# EAGLE design arduino_uno_shield (EAGLE 7.1.0)
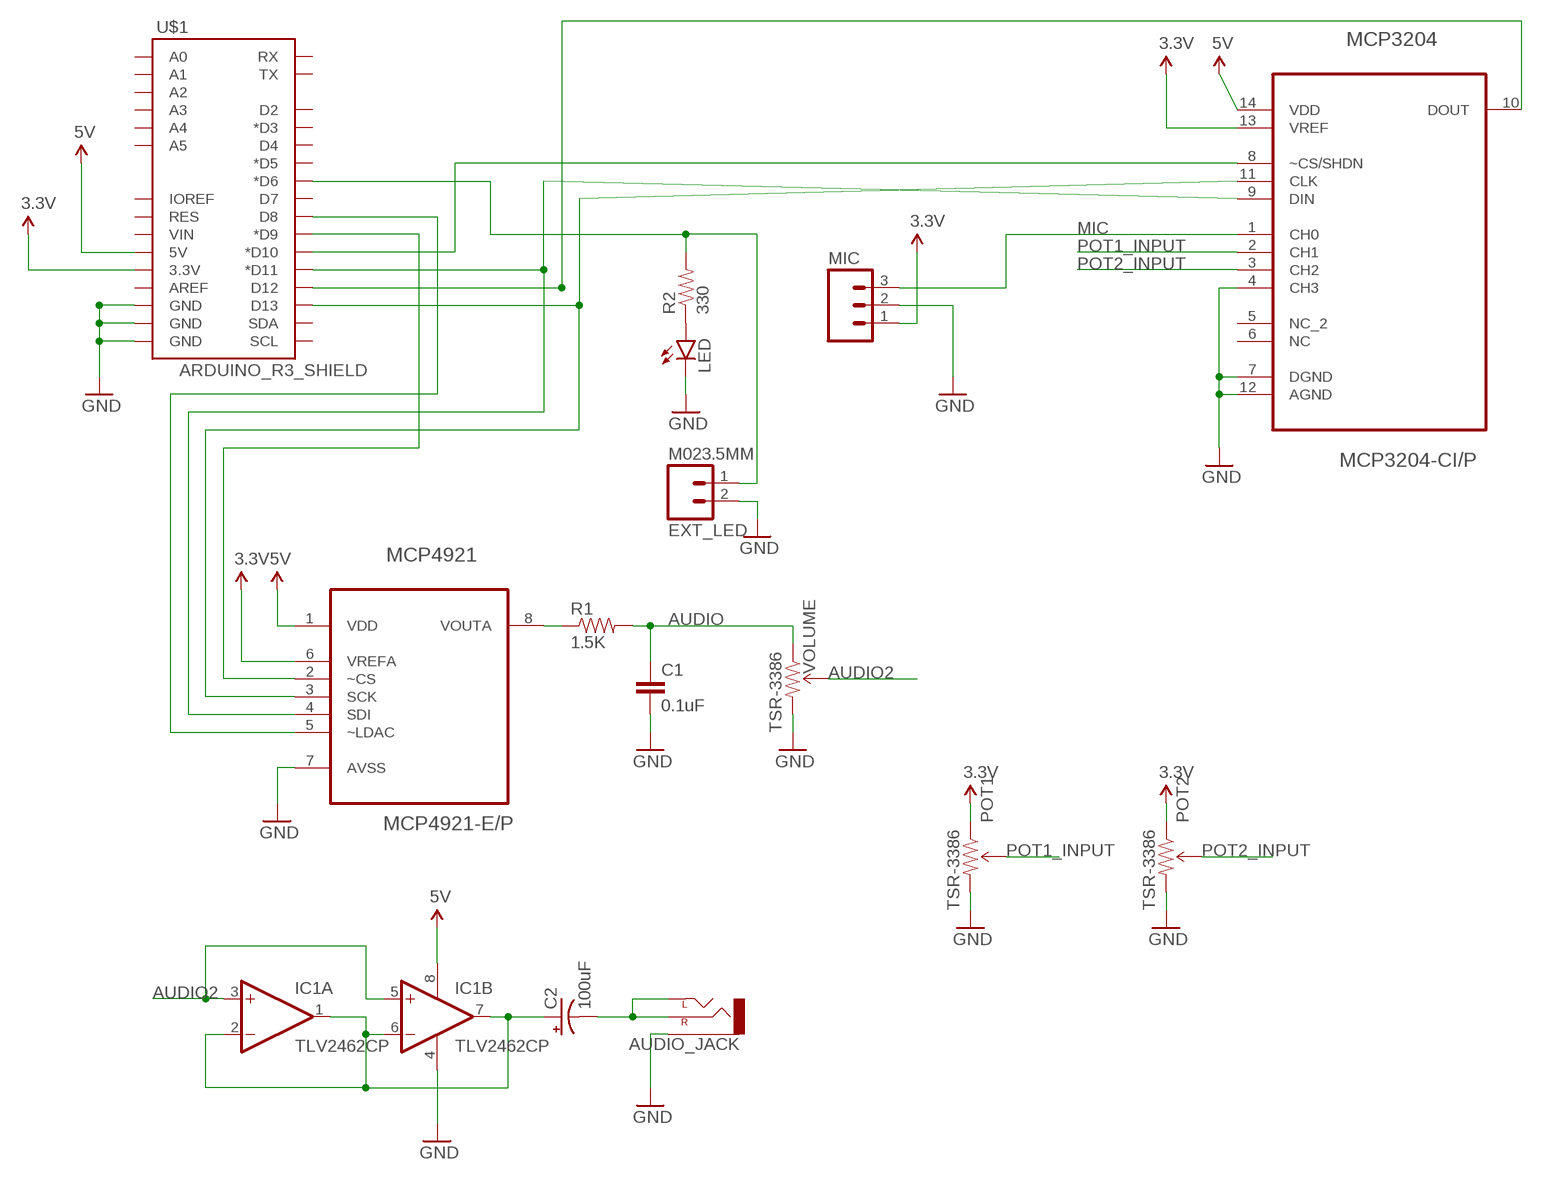
[diagram p0: schematic, sheet 1]

## Parts
AUDIO_JACK  AUDIO-JACKPTH  [AUDIO-JACK]
C1  0.1uF  CAPPTH  [CAP-PTH-SMALL]
C2  100uF  CAP_POLPTH1  [CPOL-RADIAL-100UF-25V]
EXT_LED  M023.5MM  [SCREWTERMINAL-3.5MM-2]
IC1  TLV2462CP  TL072P  [DIL08]
LED  LED5MM  [LED5MM]
MCP3204  MCP3204-CI/P  [DIP254P762X432-14]
MCP4921  MCP4921-E/P  [DIP254P762X432-8]
MIC  M03PTH  [1X03]
POT1  TSR-3386  TRIMPOT-PTH-KNOB  [3386U]
POT2  TSR-3386  TRIMPOT-PTH-KNOB  [3386U]
R1  1.5K  RESISTORPTH-1/4W  [AXIAL-0.4]
R2  330  RESISTORPTH-1/4W  [AXIAL-0.4]
U$1  ARDUINO_R3_SHIELD  [UNO_R3_SHIELD]
VOLUME  TSR-3386  TRIMPOT-PTH-KNOB  [3386U]

## Nets
3.3V: MCP3204.13(VREF) MCP4921.6(VREFA) MIC.1 POT1.1(CCW) POT2.1(CCW) U$1.3.3V
5V: IC1.8(P:V+) MCP3204.14(VDD) MCP4921.1(VDD) U$1.5V
AUDIO: C1.1 R1.P$2 VOLUME.1(CCW)
AUDIO2: IC1.3(A:+IN) IC1.5(B:+IN) VOLUME.2(WIPER)
CS_ADC: MCP3204.8(~CS/SHDN) U$1.D10(*D10)
CS_DAC: MCP4921.2(~CS) U$1.D9(*D9)
GND: AUDIO_JACK.SLEEVE C1.2 EXT_LED.2 IC1.4(P:V-) LED.K(C) MCP3204.4(CH3) MCP3204.7(DGND) MCP3204.12(AGND) MCP4921.7(AVSS) MIC.2 POT1.3(CW) POT2.3(CW) U$1.GND@0(GND) U$1.GND@1(GND) U$1.GND@2(GND) VOLUME.3(CW)
MIC: MCP3204.1(CH0) MIC.3
N$3: MCP4921.8(VOUTA) R1.P$1
N$4: C2.1(+) IC1.1(A:OUT) IC1.2(A:-IN) IC1.6(B:-IN) IC1.7(B:OUT)
N$5: AUDIO_JACK.RING(RIGHT) AUDIO_JACK.TIP(LEFT) C2.2(-)
N$10: LED.A R2.P$1
N$11: MCP4921.5(~LDAC) U$1.D8
N$12: EXT_LED.1 R2.P$2 U$1.D6(*D6)
POT1_INPUT: MCP3204.2(CH1) POT1.2(WIPER)
POT2_INPUT: MCP3204.3(CH2) POT2.2(WIPER)
SPI_CLK: MCP3204.11(CLK) MCP4921.3(SCK) U$1.D13
SPI_MISO: MCP3204.10(DOUT) U$1.D12
SPI_MOSI: MCP3204.9(DIN) MCP4921.4(SDI) U$1.D11(*D11)
Unconnected: MCP3204.5(NC_2) MCP3204.6(NC) U$1.A0 U$1.A1 U$1.A2 U$1.A3 U$1.A4 U$1.A5 U$1.AREF U$1.D2 U$1.D3(*D3) U$1.D4 U$1.D5(*D5) U$1.D7 U$1.IOREF U$1.RES U$1.RX U$1.SCL U$1.SDA U$1.TX U$1.VIN

## Library data of the parts
AUDIO_JACK = SparkFun-Connectors:AUDIO-JACK: 3.5mm Audio Jack Simple 3.5mm common PCB mount audio jack. SKU: PRT-08032
C1 = SparkFun-Passives:CAP: Capacitor Standard 0603 ceramic capacitor, and 0.1" leaded capacitor.
C2 = SparkFun-Capacitors:CAP_POL: Capacitor Polarized These are standard SMD and PTH capacitors. Normally 10uF, 47uF, and 100uF in electrolytic and tantalum varieties. Always verify the external diameter of the through hole cap, it varies with capacity, voltage, and manufacturer. The EIA devices should be standard.
EXT_LED = SparkFun-Connectors:M02: Standard 2-pin 0.1" header. Use with - straight break away headers ( PRT-00116) - right angle break away headers (PRT-00553) - swiss pins (PRT-00743) - machine pins (PRT-00117) - female headers (PRT-00115) Molex polarized connector foot print use with: PRT-08233 with associated crimp pins and housings. 2.54_SCREWTERM for use with PRT-10571. 3.5mm Screw Terminal footprints for PRT-08084 5mm Screw Terminal footprints for use with PRT-08433
IC1 = linear:TL072: OP AMP
LED = SparkFun-LED:LED: LEDs Standard schematic elements and footprints for 5mm, 3mm, 1206, and 0603 sized LEDs. 5mm - Spark Fun Electronics SKU : COM-00529 (and others)
MCP3204 = Microchip_By_element14_Batch_1:MCP3204-CI/P: A/D Converters; MPN: MCP3204-CI/P; OC_FARNELL: 9758593; OC_NEWARK: 19C7209; PACKAGE: DIP-14; SUPPLIER: Microchip
MCP4921 = Microchip_By_element14_Batch_1:MCP4921-E/P: DAC; MPN: MCP4921-E/P; OC_FARNELL: 1332112; OC_NEWARK: 08J8743; PACKAGE: DIP-8; SUPPLIER: Microchip
MIC = SparkFun-Connectors:M03: Header 3 Standard 3-pin 0.1" header. Use with straight break away headers (SKU : PRT-00116), right angle break away headers (PRT-00553), swiss pins (PRT-00743), machine pins (PRT-00117), and female headers (PRT-00115). Molex polarized connector foot print use with SKU : PRT-08232 with associated crimp pins and housings.
POT1 POT2 VOLUME = SparkFun-Electromechanical:TRIMPOT: Various small potentiometers for "set-and-forget" applications; PROD_ID: RES-09730
R1 R2 = SparkFun-Passives:RESISTOR: Resistor Basic schematic elements and footprints for 0603, 1206, and PTH resistors.
U$1 = SparkFun-Boards:ARDUINO_R3_SHIELD: Shield form compatible with the Arduino Uno R3.

## Board
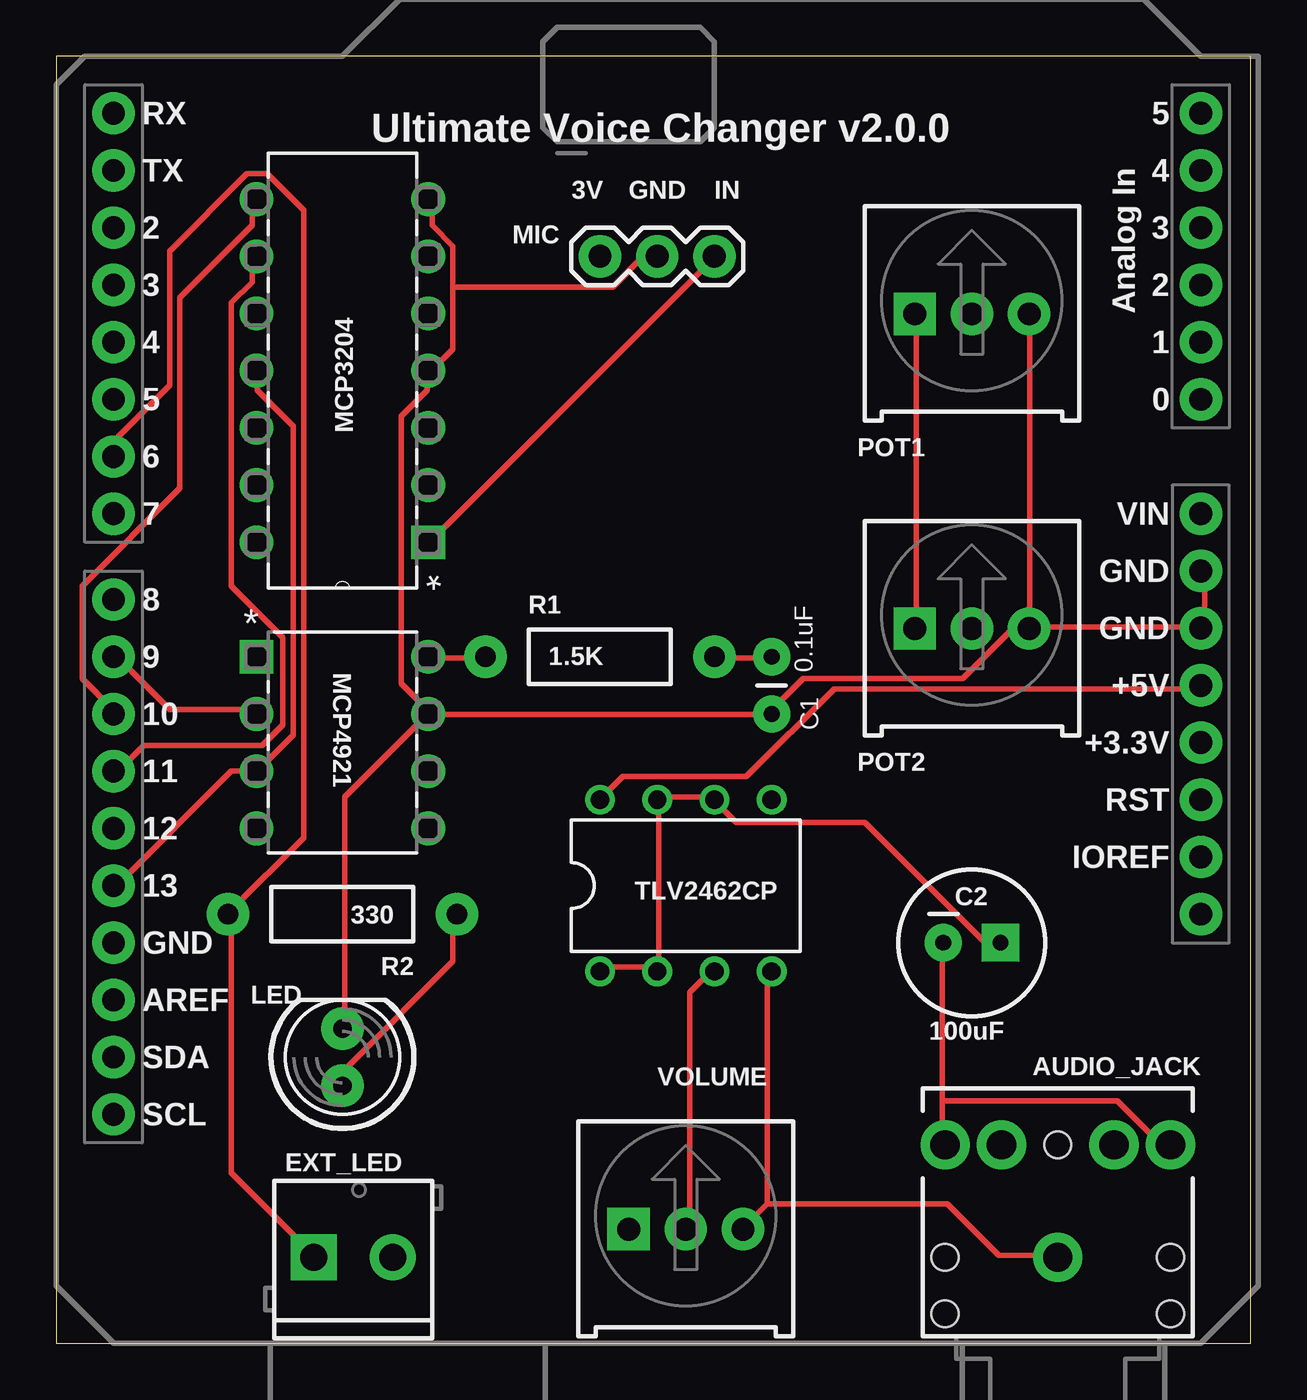
[diagram p1: board, top side]
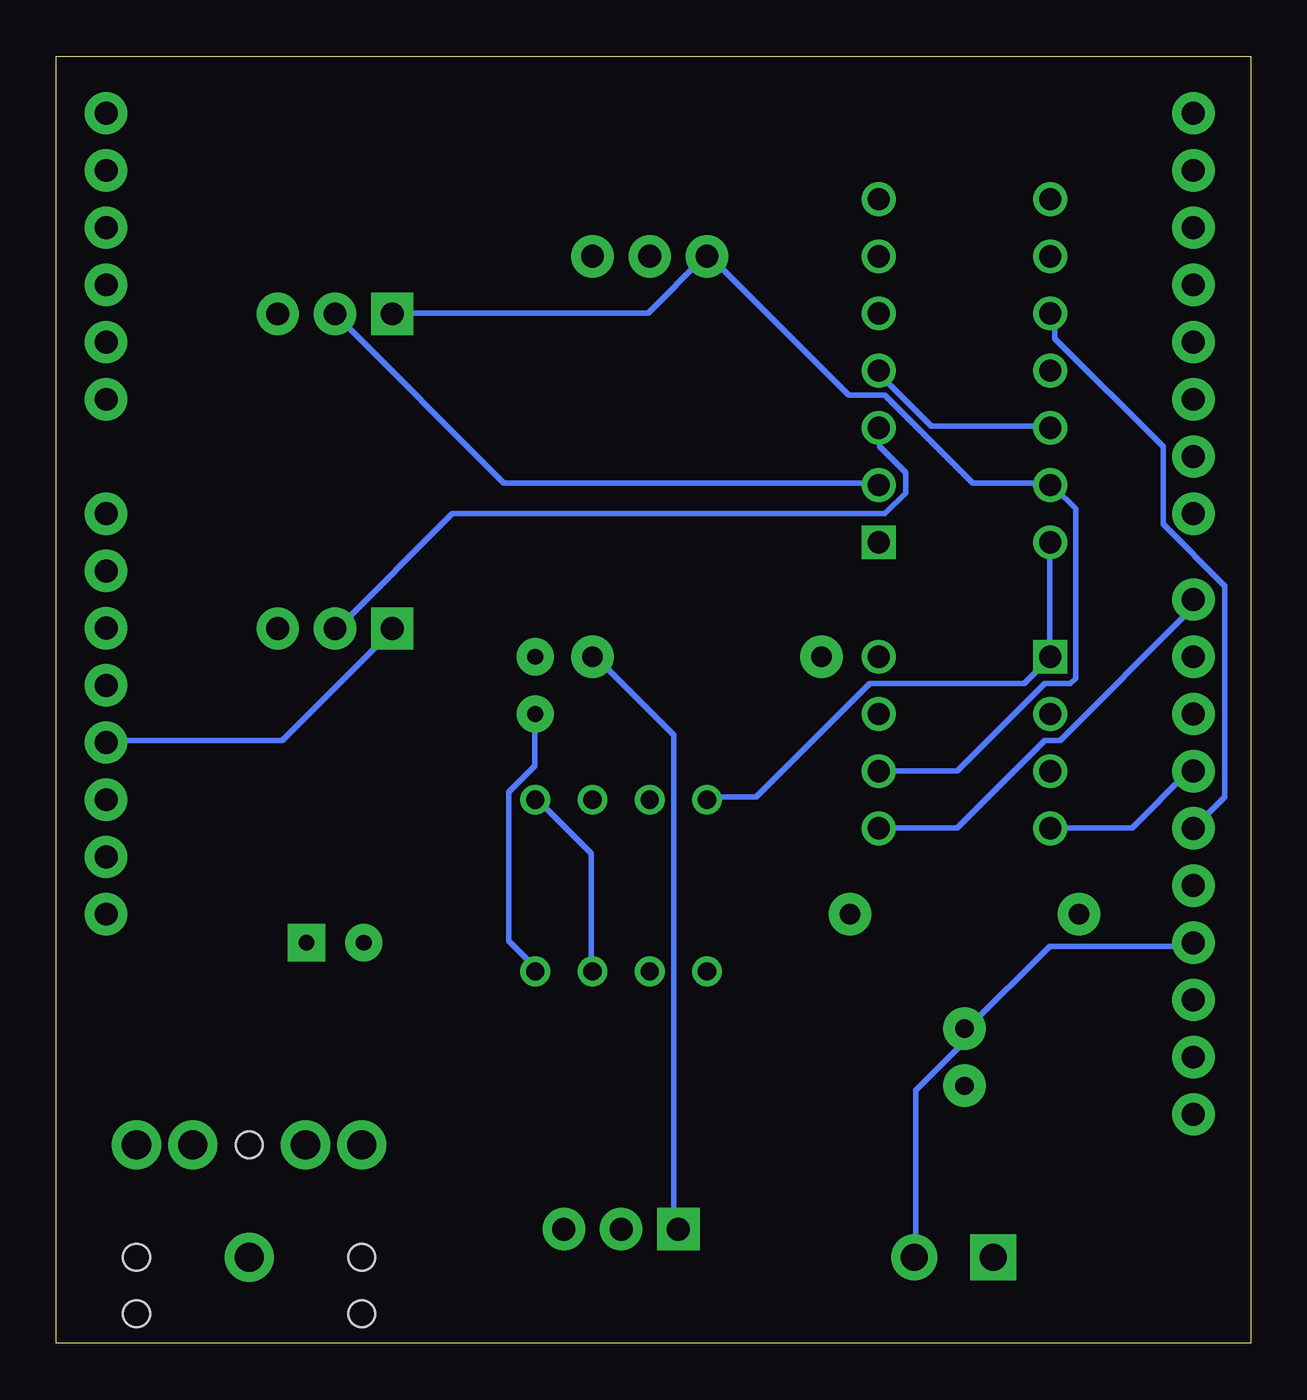
[diagram p2: board, bottom side, seen from below]

Size 53.01 x 57.14 mm. Coordinates in mm from the lower left corner, seen from the top.
Outline: 0,0 53.01,0 53.01,57.14 0,57.14 0,0
Copper layers (1*16): Top 0.035mm / dielectric 1.5mm / Bottom 0.035mm
Design rules "default": minimum track width 10mil, minimum drill 24mil, track to track 8mil, track to pad 8mil, pad to pad 8mil, via to via 8mil, smd to smd 8mil, copper to edge 40mil, drill to drill 8mil, minimum pad ring 10mil, minimum via ring 8mil, stop-mask expansion 4mil, vias tented up to drill 0mil, thermal gap 10mil

### Footprints (pad centres in the part's own frame; a part is rotated, then mirrored left to right if it is on the bottom)
AUDIO-JACK = drill 1.3 pad 2.184: RING 5,5; RSH 5,2.5; SLEEVE 0,0; TIP 5,-5; TSH 5,-2.5 | hole 1.2: 0,5; -2.5,5; -2.5,-5; 0,-5; 5,0
CAP-PTH-SMALL = drill 0.7 pad 1.651: 1 0,0; 2 2.54,0
CPOL-RADIAL-100UF-25V = drill 0.7 pad 1.651 square: 1 1.27,0 | drill 0.7 pad 1.651: 2 -1.27,0
SCREWTERMINAL-3.5MM-2 = drill 1.2 pad 2.032 square: 1 0,0 | drill 1.2 pad 2.032: 2 3.5,0
DIL08 = drill 0.813 pad 1.27: 1 -3.81,-3.81; 2 -1.27,-3.81; 3 1.27,-3.81; 4 3.81,-3.81; 5 3.81,3.81; 6 1.27,3.81; 7 -1.27,3.81; 8 -3.81,3.81
LED5MM = drill 0.813 pad 1.88: A -1.27,0; K 1.27,0
DIP254P762X432-14 = drill 0.991 square: 1 -7.62,15.24 | drill 0.991: 2 -7.62,12.7; 3 -7.62,10.16; 4 -7.62,7.62; 5 -7.62,5.08; 6 -7.62,2.54; 7 -7.62,0; 8 0,0; 9 0,2.54; 10 0,5.08; 11 0,7.62; 12 0,10.16; 13 0,12.7; 14 0,15.24
DIP254P762X432-8 = drill 0.991 square: 1 -7.62,7.62 | drill 0.991: 2 -7.62,5.08; 3 -7.62,2.54; 4 -7.62,0; 5 0,0; 6 0,2.54; 7 0,5.08; 8 0,7.62
1X03 = drill 1.016 pad 1.88: 1 0,0; 2 2.54,0; 3 5.08,0
3386U = drill 1.016 pad 1.88 square: 1 -2.54,-0.015 | drill 1.016 pad 1.88: 2 0,-0.015; 3 2.54,-0.015
AXIAL-0.4 = drill 0.9 pad 1.88: P$1 -5.08,0; P$2 5.08,0
UNO_R3_SHIELD = drill 1.016 pad 1.88: 3.3V 50.8,26.67; 5V 50.8,29.21; A0 50.8,41.91; A1 50.8,44.45; A2 50.8,46.99; A3 50.8,49.53; A4 50.8,52.07; A5 50.8,54.61; AREF 2.54,15.24; D2 2.54,49.53; D3 2.54,46.99; D4 2.54,44.45; D5 2.54,41.91; D6 2.54,39.37; D7 2.54,36.83; D8 2.54,33.02; D9 2.54,30.48; D10 2.54,27.94; D11 2.54,25.4; D12 2.54,22.86; D13 2.54,20.32; GND@0 50.8,31.75; GND@1 50.8,34.29; GND@2 2.54,17.78; IOREF 50.8,21.59; NC 50.8,19.05; RES 50.8,24.13; RX 2.54,54.61; SCL 2.54,10.16; SDA 2.54,12.7; TX 2.54,52.07; VIN 50.8,36.83

### Placement (x,y rotation side)
AUDIO_JACK  44.45,3.81 90 top
C1  31.75,30.48 270 top
C2  40.64,17.78 0 top
EXT_LED  11.43,3.81 0 top
IC1  27.94,20.32 0 top
LED  12.7,12.7 90 top
MCP3204  8.89,50.8 180 top
MCP4921  16.51,22.86 0 top
MIC  24.13,48.26 0 top
POT1  40.64,45.72 0 top
POT2  40.64,31.75 0 top
R1  24.13,30.48 0 top
R2  12.7,19.05 180 top
U$1  0,0 0 top
VOLUME  27.94,5.08 0 top

### Tracks (layer width: path | path; a pad name or v marks a point on that pad's centre or on a via)
3.3V
  Top 0.254: POT2.1 38.18,31.8 38.18,45.52 POT1.1
  Bottom 0.254: U$1.3.3V 50.75,26.77 42.98,26.77 38.18,31.57 POT2.1 | MCP4921.6 13.03,25.4 9.14,29.29 8,29.29 7.77,29.52 7.77,37.06 8.69,37.97 MCP3204.13 8.91,38.2 12.34,38.2 16.23,42.09 17.83,42.09 24,48.26 MIC.1 24.23,48.26 26.75,45.74 37.95,45.74 POT1.1
5V
  Top 0.254: U$1.5V 50.75,29.06 34.52,29.06 30.63,25.17 25.15,25.17 24.23,24.26 IC1.8
  Bottom 0.254: IC1.8 24,24.26 21.95,24.26 16.92,29.29 10.06,29.29 8.91,30.43 MCP4921.1 8.91,30.66 8.91,35.46 MCP3204.14
AUDIO
  Top 0.254: C1.1 31.55,30.43 29.26,30.43 R1.P$2
  Bottom 0.254: VOLUME.1 25.6,5.28 25.6,27 29.03,30.43 R1.P$2
AUDIO2
  Top 0.254: VOLUME.2 28.12,5.28 28.12,15.57 29.03,16.48 IC1.3
  Bottom 0.254: IC1.3 29.26,16.71 29.26,21.74 31.55,24.03 IC1.5
CS_ADC
  Top 0.254: MCP3204.8 8.69,50.77 8.69,49.63 5.49,46.43 5.49,37.97 1.14,33.63 1.14,29.52 2.52,28.14 U$1.D10
CS_DAC
  Top 0.254: MCP4921.2 8.69,28.14 5.03,28.14 2.74,30.43 U$1.D9
GND
  Top 0.254: 17.6,46.89 17.6,44.15 16.69,43.23 MCP3204.4 16.46,43 16.46,42.32 15.32,41.17 15.32,29.29 16.46,28.14 MCP4921.7 | 17.6,46.89 17.6,48.72 16.69,49.63 16.69,50.77 MCP3204.7 | MIC.2 26.06,48.26 24.69,46.89 17.6,46.89 | 43.2,31.8 50.75,31.8 U$1.GND@0 50.98,31.8 50.98,34.09 U$1.GND@1 | 43.2,31.8 43.2,45.52 POT1.3 | 43.2,31.8 POT2.3 42.98,31.57 42.29,31.57 40.23,29.52 33.15,29.52 31.77,28.14 C1.2 31.55,27.91 16.69,27.91 MCP4921.7 | 31.55,6.2 31.55,16.48 IC1.4 | 31.55,6.2 30.63,5.28 VOLUME.3 | 31.55,6.2 39.55,6.2 41.83,3.91 44.35,3.91 AUDIO_JACK.SLEEVE | LED.K 12.8,13.97 12.8,24.26 16.46,27.91 MCP4921.7
  Bottom 0.254: EXT_LED.2 14.86,3.91 14.86,11.23 12.8,13.28 12.8,13.97 LED.K 12.57,13.97 8.91,17.63 2.74,17.63 U$1.GND@2 | MCP3204.12 8.91,40.72 14.17,40.72 16.46,43 MCP3204.4 | C1.2 31.77,27.91 31.77,25.63 32.92,24.49 32.92,17.86 31.77,16.71 IC1.4
MIC
  Top 0.254: MCP3204.1 16.69,35.69 29.26,48.26 MIC.3
N$3
  Top 0.254: MCP4921.8 16.69,30.43 18.97,30.43 R1.P$1
N$4
  Top 0.254: IC1.1 24.23,16.71 26.52,16.71 IC1.2 26.75,16.71 26.75,24.03 IC1.7 26.75,24.26 29.03,24.26 IC1.6 29.26,24.03 30.18,23.11 35.89,23.11 41.15,17.86 41.83,17.86 C2.1
N$5
  Top 0.254: 39.32,10.77 39.32,8.94 AUDIO_JACK.RING | 39.32,10.77 39.32,17.63 C2.2 | 39.32,10.77 47.09,10.77 48.92,8.94 49.38,8.94 AUDIO_JACK.TIP
N$10
  Top 0.254: LED.A 12.8,11.45 12.8,12.14 17.6,16.94 17.6,19 R2.P$1
N$11
  Bottom 0.254: MCP4921.5 16.46,22.88 13.03,22.88 9.14,26.77 8.46,26.77 2.74,32.49 2.74,32.94 U$1.D8
N$12
  Top 0.254: EXT_LED.1 11.43,3.91 7.77,7.57 7.77,19 R2.P$2 7.77,19.23 10.97,22.43 10.97,50.32 9.37,51.92 8.46,51.92 5.03,48.49 5.03,42.55 2.74,40.26 2.74,39.57 U$1.D6
POT1_INPUT
  Bottom 0.254: MCP3204.2 16.69,38.2 33.15,38.2 40.46,45.52 POT1.2
POT2_INPUT
  Bottom 0.254: MCP3204.3 16.46,40.49 16.46,39.8 15.32,38.66 15.32,37.74 16.23,36.83 35.43,36.83 40.46,31.8 POT2.2
SPI_CLK
  Top 0.254: U$1.D13 2.74,20.37 7.77,25.4 MCP4921.3 8.91,25.4 10.52,27 10.52,40.72 8.91,42.32 8.91,43 MCP3204.11
SPI_MISO
  Bottom 0.254: U$1.D12 1.14,24.26 1.14,33.63 3.89,36.37 3.89,39.8 8.69,44.6 8.69,45.52 MCP3204.10
SPI_MOSI
  Top 0.254: MCP3204.9 8.69,48.26 8.69,47.12 7.77,46.2 7.77,33.63 10.06,31.34 10.06,27.46 9.14,26.54 3.89,26.54 2.74,25.4 U$1.D11
  Bottom 0.254: MCP4921.4 8.69,22.88 5.26,22.88 2.74,25.4 U$1.D11

### Text on the board
tPlace: Ultimate Voice Changer v2.0.0 | 3V | GND | IN